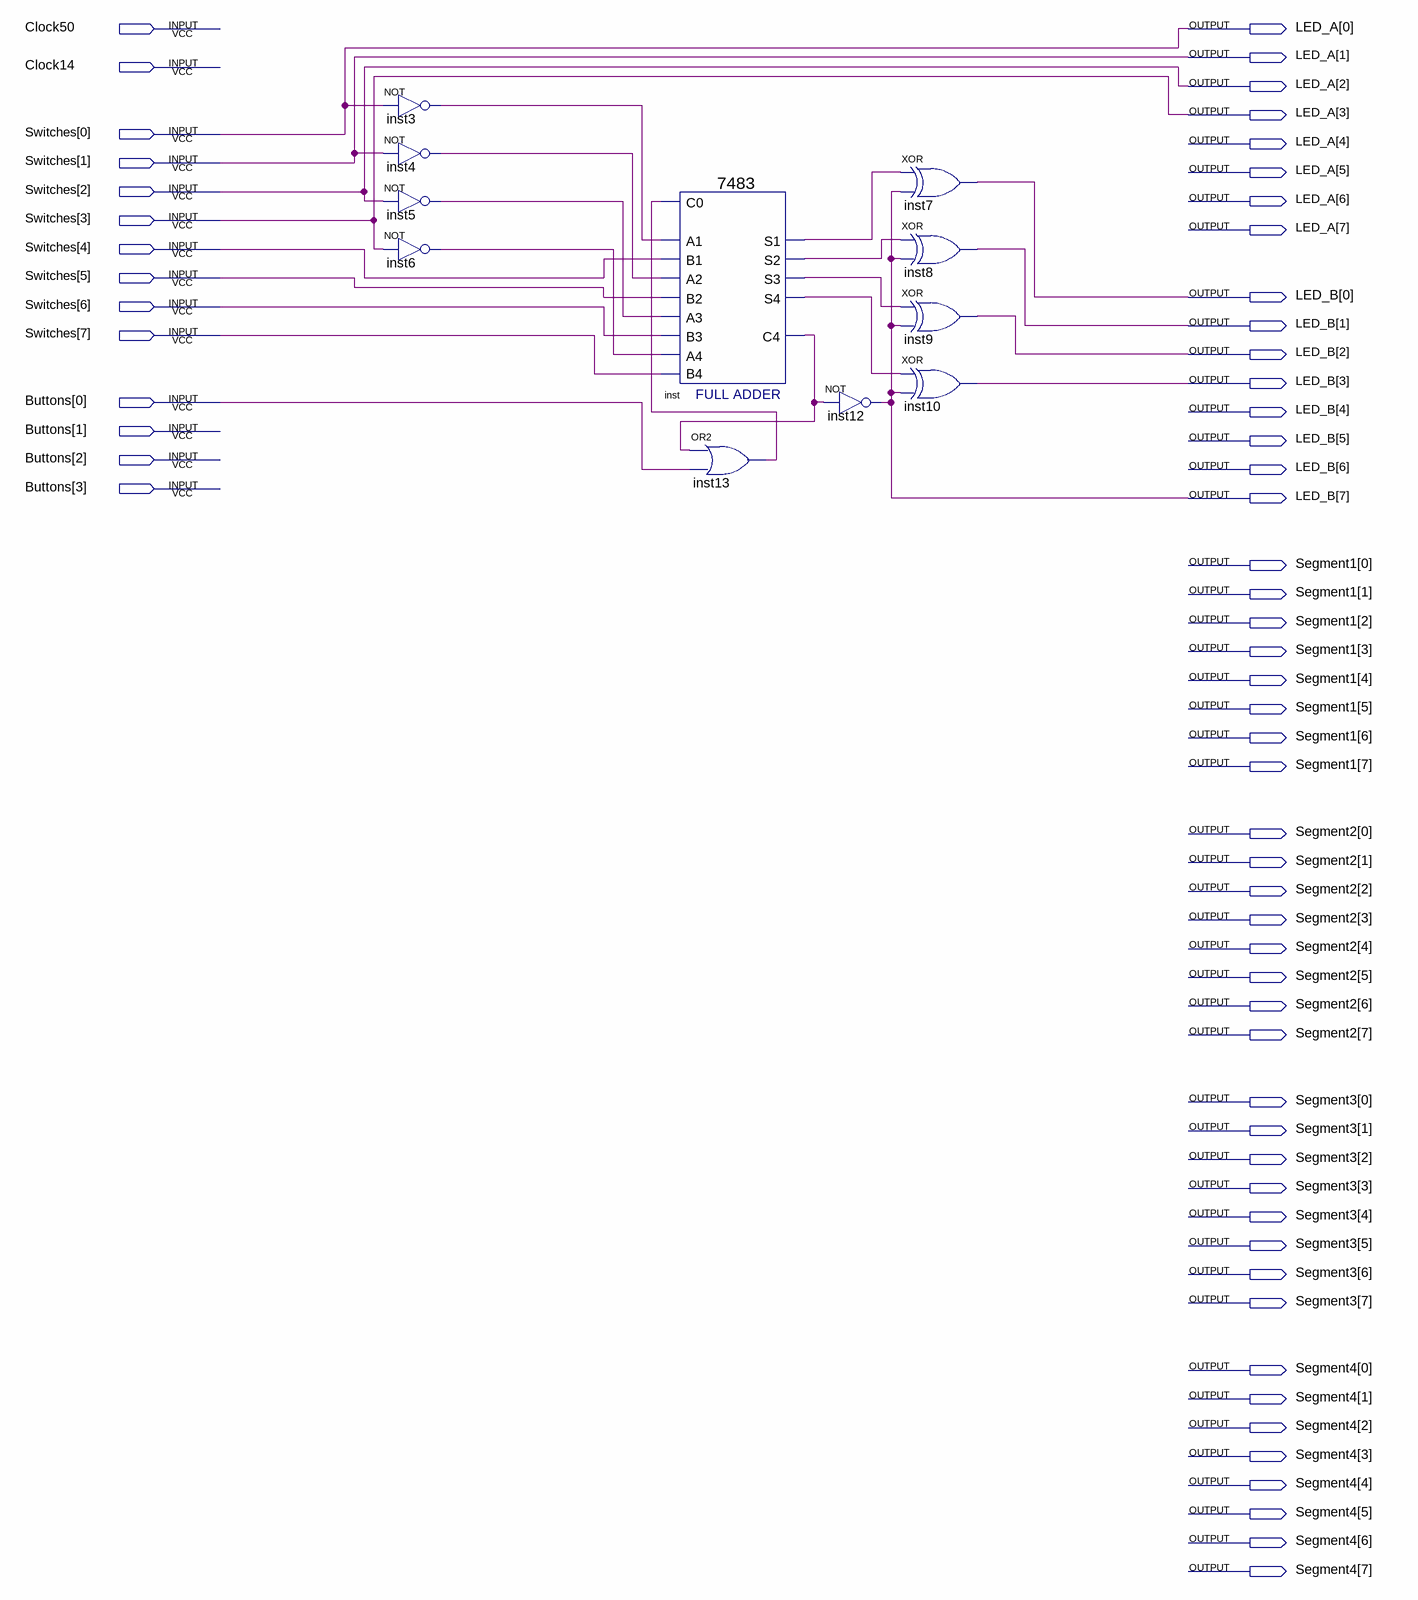
[diagram p0: schematic sheet]
// Quartus schematic Subtrahierer.bdf as structural Verilog: 11 symbols, 62 pins
module Subtrahierer (
  input  Clock50,
  input  Clock14,
  input  [7:0] Switches,
  input  [3:0] Buttons,
  output [7:0] LED_A,
  output [7:0] LED_B,
  output [7:0] Segment1,
  output [7:0] Segment2,
  output [7:0] Segment3,
  output [7:0] Segment4
);

  wire inst3_out, inst4_out, inst5_out, inst6_out, inst13_out, inst_c4, inst_s1, inst_s2, inst_s3, inst_s4;

  not inst3 (inst3_out, Switches[0]);
  not inst4 (inst4_out, Switches[1]);
  not inst5 (inst5_out, Switches[2]);
  not inst6 (inst6_out, Switches[3]);
  \7483  inst (
    .B4(Switches[7]), .C0(inst13_out), .A1(inst3_out), .A2(inst4_out), .B1(Switches[4]), .B2(Switches[5]),
    .A3(inst5_out), .B3(Switches[6]), .A4(inst6_out), .S3(inst_s3), .S4(inst_s4), .S2(inst_s2), .C4(inst_c4),
    .S1(inst_s1));
  or inst13 (inst13_out, inst_c4, Buttons[0]);
  not inst12 (LED_B[7], inst_c4);
  xor inst7 (LED_B[0], inst_s1, LED_B[7]);
  xor inst8 (LED_B[1], inst_s2, LED_B[7]);
  xor inst9 (LED_B[2], inst_s3, LED_B[7]);
  xor inst10 (LED_B[3], inst_s4, LED_B[7]);

  assign LED_A[3:0] = Switches[3:0];
endmodule
